# EAGLE schematic LEDcube (EAGLE 6.5.0)
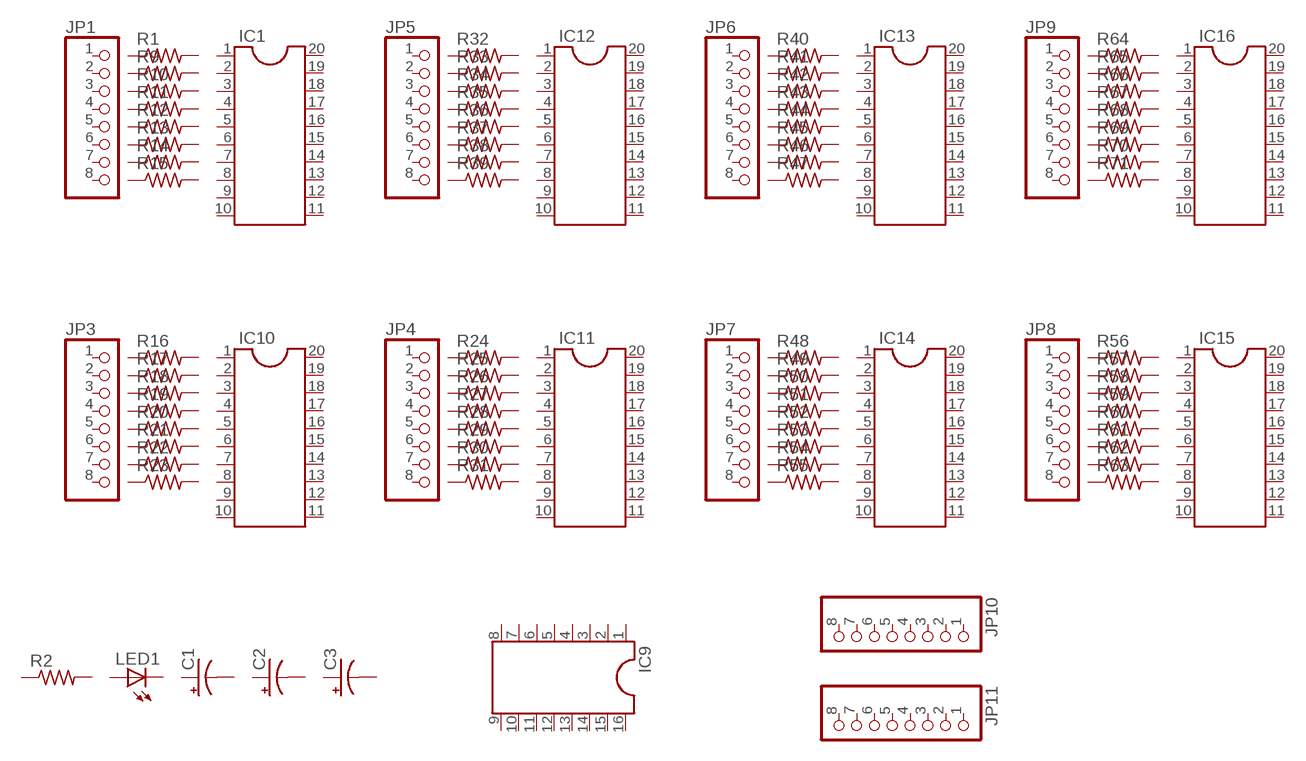
[diagram p0: schematic, sheet 1]

## Parts
C1  CPOL-USE1.8-4  [E1,8-4]
C2  CPOL-USE1.8-4  [E1,8-4]
C3  CPOL-USE1.8-4  [E1,8-4]
IC1  DIL20S  [SOCKET-20]
IC9  DIL16S  [SOCKET-16]
IC10  DIL20S  [SOCKET-20]
IC11  DIL20S  [SOCKET-20]
IC12  DIL20S  [SOCKET-20]
IC13  DIL20S  [SOCKET-20]
IC14  DIL20S  [SOCKET-20]
IC15  DIL20S  [SOCKET-20]
IC16  DIL20S  [SOCKET-20]
JP1  PINHD-1X8  [1X08]
JP3  PINHD-1X8  [1X08]
JP4  PINHD-1X8  [1X08]
JP5  PINHD-1X8  [1X08]
JP6  PINHD-1X8  [1X08]
JP7  PINHD-1X8  [1X08]
JP8  PINHD-1X8  [1X08]
JP9  PINHD-1X8  [1X08]
JP10  PINHD-1X8  [1X08]
JP11  PINHD-1X8  [1X08]
LED1  LED5MM  [LED5MM]
R1  R-US_0411/12  [0411/12]
R2  R-US_0411/12  [0411/12]
R9  R-US_0411/12  [0411/12]
R10  R-US_0411/12  [0411/12]
R11  R-US_0411/12  [0411/12]
R12  R-US_0411/12  [0411/12]
R13  R-US_0411/12  [0411/12]
R14  R-US_0411/12  [0411/12]
R15  R-US_0411/12  [0411/12]
R16  R-US_0411/12  [0411/12]
R17  R-US_0411/12  [0411/12]
R18  R-US_0411/12  [0411/12]
R19  R-US_0411/12  [0411/12]
R20  R-US_0411/12  [0411/12]
R21  R-US_0411/12  [0411/12]
R22  R-US_0411/12  [0411/12]
R23  R-US_0411/12  [0411/12]
R24  R-US_0411/12  [0411/12]
R25  R-US_0411/12  [0411/12]
R26  R-US_0411/12  [0411/12]
R27  R-US_0411/12  [0411/12]
R28  R-US_0411/12  [0411/12]
R29  R-US_0411/12  [0411/12]
R30  R-US_0411/12  [0411/12]
R31  R-US_0411/12  [0411/12]
R32  R-US_0411/12  [0411/12]
R33  R-US_0411/12  [0411/12]
R34  R-US_0411/12  [0411/12]
R35  R-US_0411/12  [0411/12]
R36  R-US_0411/12  [0411/12]
R37  R-US_0411/12  [0411/12]
R38  R-US_0411/12  [0411/12]
R39  R-US_0411/12  [0411/12]
R40  R-US_0411/12  [0411/12]
R41  R-US_0411/12  [0411/12]
R42  R-US_0411/12  [0411/12]
R43  R-US_0411/12  [0411/12]
R44  R-US_0411/12  [0411/12]
R45  R-US_0411/12  [0411/12]
R46  R-US_0411/12  [0411/12]
R47  R-US_0411/12  [0411/12]
R48  R-US_0411/12  [0411/12]
R49  R-US_0411/12  [0411/12]
R50  R-US_0411/12  [0411/12]
R51  R-US_0411/12  [0411/12]
R52  R-US_0411/12  [0411/12]
R53  R-US_0411/12  [0411/12]
R54  R-US_0411/12  [0411/12]
R55  R-US_0411/12  [0411/12]
R56  R-US_0411/12  [0411/12]
R57  R-US_0411/12  [0411/12]
R58  R-US_0411/12  [0411/12]
R59  R-US_0411/12  [0411/12]
R60  R-US_0411/12  [0411/12]
R61  R-US_0411/12  [0411/12]
R62  R-US_0411/12  [0411/12]
R63  R-US_0411/12  [0411/12]
R64  R-US_0411/12  [0411/12]
R65  R-US_0411/12  [0411/12]
R66  R-US_0411/12  [0411/12]
R67  R-US_0411/12  [0411/12]
R68  R-US_0411/12  [0411/12]
R69  R-US_0411/12  [0411/12]
R70  R-US_0411/12  [0411/12]
R71  R-US_0411/12  [0411/12]
Unconnected: C1.+ C1.- C2.+ C2.- C3.+ C3.- IC1.1 IC1.2 IC1.3 IC1.4 IC1.5 IC1.6 IC1.7 IC1.8 IC1.9 IC1.10 IC1.11 IC1.12 IC1.13 IC1.14 IC1.15 IC1.16 IC1.17 IC1.18 IC1.19 IC1.20 IC9.1 IC9.2 IC9.3 IC9.4 IC9.5 IC9.6 IC9.7 IC9.8 IC9.9 IC9.10 IC9.11 IC9.12 IC9.13 IC9.14 IC9.15 IC9.16 IC10.1 IC10.2 IC10.3 IC10.4 IC10.5 IC10.6 IC10.7 IC10.8 IC10.9 IC10.10 IC10.11 IC10.12 IC10.13 IC10.14 IC10.15 IC10.16 IC10.17 IC10.18 IC10.19 IC10.20 IC11.1 IC11.2 IC11.3 IC11.4 IC11.5 IC11.6 IC11.7 IC11.8 IC11.9 IC11.10 IC11.11 IC11.12 IC11.13 IC11.14 IC11.15 IC11.16 IC11.17 IC11.18 IC11.19 IC11.20 IC12.1 IC12.2 IC12.3 IC12.4 IC12.5 IC12.6 IC12.7 IC12.8 IC12.9 IC12.10 IC12.11 IC12.12 IC12.13 IC12.14 IC12.15 IC12.16 IC12.17 IC12.18 IC12.19 IC12.20 IC13.1 IC13.2 IC13.3 IC13.4 IC13.5 IC13.6 IC13.7 IC13.8 IC13.9 IC13.10 IC13.11 IC13.12 IC13.13 IC13.14 IC13.15 IC13.16 IC13.17 IC13.18 IC13.19 IC13.20 IC14.1 IC14.2 IC14.3 IC14.4 IC14.5 IC14.6 IC14.7 IC14.8 IC14.9 IC14.10 IC14.11 IC14.12 IC14.13 IC14.14 IC14.15 IC14.16 IC14.17 IC14.18 IC14.19 IC14.20 IC15.1 IC15.2 IC15.3 IC15.4 IC15.5 IC15.6 IC15.7 IC15.8 IC15.9 IC15.10 IC15.11 IC15.12 IC15.13 IC15.14 IC15.15 IC15.16 IC15.17 IC15.18 IC15.19 IC15.20 IC16.1 IC16.2 IC16.3 IC16.4 IC16.5 IC16.6 IC16.7 IC16.8 IC16.9 IC16.10 IC16.11 IC16.12 IC16.13 IC16.14 IC16.15 IC16.16 IC16.17 IC16.18 IC16.19 IC16.20 JP1.1 JP1.2 JP1.3 JP1.4 JP1.5 JP1.6 JP1.7 JP1.8 JP3.1 JP3.2 JP3.3 JP3.4 JP3.5 JP3.6 JP3.7 JP3.8 JP4.1 JP4.2 JP4.3 JP4.4 JP4.5 JP4.6 JP4.7 JP4.8 JP5.1 JP5.2 JP5.3 JP5.4 JP5.5 JP5.6 JP5.7 JP5.8 JP6.1 JP6.2 JP6.3 JP6.4 JP6.5 JP6.6 JP6.7 JP6.8 JP7.1 JP7.2 JP7.3 JP7.4 JP7.5 JP7.6 JP7.7 JP7.8 JP8.1 JP8.2 JP8.3 JP8.4 JP8.5 JP8.6 JP8.7 JP8.8 JP9.1 JP9.2 JP9.3 JP9.4 JP9.5 JP9.6 JP9.7 JP9.8 JP10.1 JP10.2 JP10.3 JP10.4 JP10.5 JP10.6 JP10.7 JP10.8 JP11.1 JP11.2 JP11.3 JP11.4 JP11.5 JP11.6 JP11.7 JP11.8 LED1.A LED1.K(C) R1.1 R1.2 R2.1 R2.2 R9.1 R9.2 R10.1 R10.2 R11.1 R11.2 R12.1 R12.2 R13.1 R13.2 R14.1 R14.2 R15.1 R15.2 R16.1 R16.2 R17.1 R17.2 R18.1 R18.2 R19.1 R19.2 R20.1 R20.2 R21.1 R21.2 R22.1 R22.2 R23.1 R23.2 R24.1 R24.2 R25.1 R25.2 R26.1 R26.2 R27.1 R27.2 R28.1 R28.2 R29.1 R29.2 R30.1 R30.2 R31.1 R31.2 R32.1 R32.2 R33.1 R33.2 R34.1 R34.2 R35.1 R35.2 R36.1 R36.2 R37.1 R37.2 R38.1 R38.2 R39.1 R39.2 R40.1 R40.2 R41.1 R41.2 R42.1 R42.2 R43.1 R43.2 R44.1 R44.2 R45.1 R45.2 R46.1 R46.2 R47.1 R47.2 R48.1 R48.2 R49.1 R49.2 R50.1 R50.2 R51.1 R51.2 R52.1 R52.2 R53.1 R53.2 R54.1 R54.2 R55.1 R55.2 R56.1 R56.2 R57.1 R57.2 R58.1 R58.2 R59.1 R59.2 R60.1 R60.2 R61.1 R61.2 R62.1 R62.2 R63.1 R63.2 R64.1 R64.2 R65.1 R65.2 R66.1 R66.2 R67.1 R67.2 R68.1 R68.2 R69.1 R69.2 R70.1 R70.2 R71.1 R71.2

## Library data of the parts
C1-C3 = resistor:CPOL-US: POLARIZED CAPACITOR, American symbol
IC1 IC10-IC16 = ic-package:DIL20: Dual In Line / Socket
IC9 = ic-package:DIL16: Dual In Line / Socket
JP1 JP3-JP11 = pinhead:PINHD-1X8: PIN HEADER
LED1 = led:LED: LED OSRAM: - CHIPLED LG R971, LG N971, LY N971, LG Q971, LY Q971, LO R971, LY R971 LH N974, LH R974 LS Q976, LO Q976, LY Q976 LO Q996 - Hyper CHIPLED LW Q18S LB Q993, LB Q99A, LB R99A - SideLED LS A670, LO A670, LY A670, LG A670, LP A670 LB A673, LV A673, LT A673, LW A673 LH A674 LY A675 LS A676, LA A676, LO A676, LY A676, LW A676 LS A679, LY A679, LG A679 - Hyper Micro SIDELED® LS Y876, LA Y876, LO Y876, LY Y876 LT Y87S - SmartLED LW L88C, LW L88S LB L89C, LB L89S, LG L890 LS L89K, LO L89K, LY L89K LS L896, LA L896, LO L896, LY L896 - TOPLED LS T670, LO T670, LY T670, LG T670, LP T670 LSG T670, LSP T670, LSY T670, LOP T670, LYG T670 LG T671, LOG T671, LSG T671 LB T673, LV T673, LT T673, LW T673 LH T674 LS T676, LA T676, LO T676, LY T676, LB T676, LH T676, LSB T676, LW T676 LB T67C, LV T67C, LT T67C, LS T67K, LO T67K, LY T67K, LW E67C LS E67B, LA E67B, LO E67B, LY E67B, LB E67C, LV E67C, LT E67C LW T67C LS T679, LY T679, LG T679 LS T770, LO T770, LY T770, LG T770, LP T770 LB T773, LV T773, LT T773, LW T773 LH T774 LS E675, LA E675, LY E675, LS T675 LS T776, LA T776, LO T776, LY T776, LB T776 LHGB T686 LT T68C, LB T68C - Hyper Mini TOPLED® LB M676 - Mini TOPLED Santana® LG M470 LS M47K, LO M47K, LY M47K Source: http://www.osram.convergy.de LUXEON: - LUMILED® LXK2-PW12-R00, LXK2-PW12-S00, LXK2-PW14-U00, LXK2-PW14-V00 LXK2-PM12-R00, LXK2-PM12-S00, LXK2-PM14-U00 LXK2-PE12-Q00, LXK2-PE12-R00, LXK2-PE12-S00, LXK2-PE14-T00, LXK2-PE14-U00 LXK2-PB12-K00, LXK2-PB12-L00, LXK2-PB12-M00, LXK2-PB14-N00, LXK2-PB14-P00, LXK2-PB14-Q00 LXK2-PR12-L00, LXK2-PR12-M00, LXK2-PR14-Q00, LXK2-PR14-R00 LXK2-PD12-Q00, LXK2-PD12-R00, LXK2-PD12-S00 LXK2-PH12-R00, LXK2-PH12-S00 LXK2-PL12-P00, LXK2-PL12-Q00, LXK2-PL12-R00 Source: www.luxeon.com KINGBRIGHT: KA-3528ASYC Source: www.kingbright.com
R1 R2 R9-R71 = resistor:R-US_: RESISTOR, American symbol